# EAGLE design FFC-Extender_v10 (EAGLE 7.3.0)
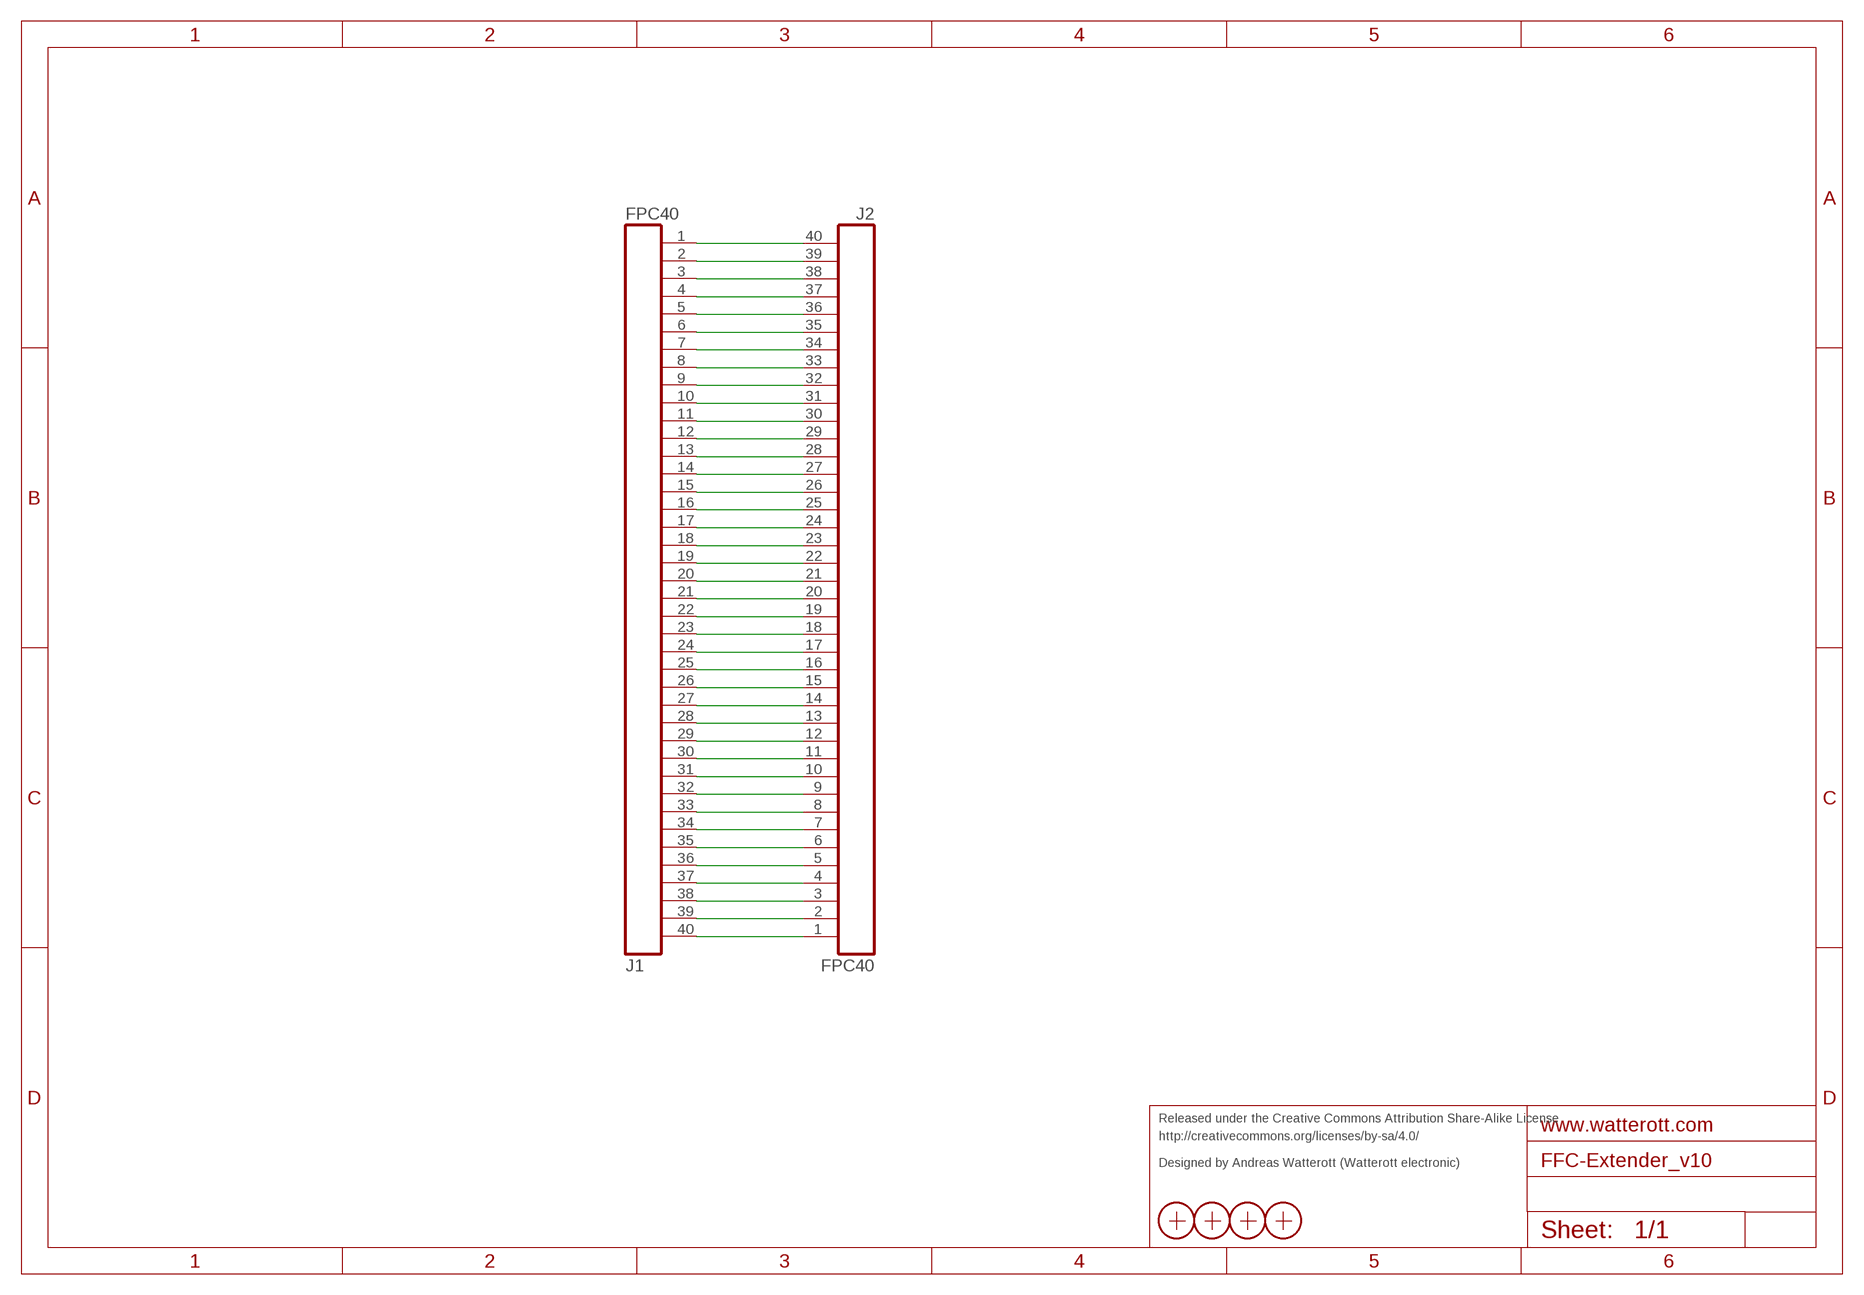
[diagram p0: schematic, sheet 1]

## Parts
J1  FPC40  [FPC40]
J2  FPC40  [FPC40]
X1  PASSER  [PASSER]
X2  PASSER  [PASSER]
X3  PASSER  [PASSER]
X4  PASSER  [PASSER]

## Nets
N$1: J1.1 J2.40
N$2: J1.2 J2.39
N$3: J1.3 J2.38
N$4: J1.4 J2.37
N$5: J1.5 J2.36
N$6: J1.6 J2.35
N$7: J1.7 J2.34
N$8: J1.8 J2.33
N$9: J1.9 J2.32
N$10: J1.10 J2.31
N$11: J1.11 J2.30
N$12: J1.12 J2.29
N$13: J1.13 J2.28
N$14: J1.14 J2.27
N$15: J1.15 J2.26
N$16: J1.16 J2.25
N$17: J1.17 J2.24
N$18: J1.18 J2.23
N$19: J1.19 J2.22
N$20: J1.20 J2.21
N$21: J1.21 J2.20
N$22: J1.22 J2.19
N$23: J1.23 J2.18
N$24: J1.24 J2.17
N$25: J1.25 J2.16
N$26: J1.26 J2.15
N$27: J1.27 J2.14
N$28: J1.28 J2.13
N$29: J1.29 J2.12
N$30: J1.30 J2.11
N$31: J1.31 J2.10
N$32: J1.32 J2.9
N$33: J1.33 J2.8
N$34: J1.34 J2.7
N$35: J1.35 J2.6
N$36: J1.36 J2.5
N$37: J1.37 J2.4
N$38: J1.38 J2.3
N$39: J1.39 J2.2
N$40: J1.40 J2.1

## Notes on the sheet
- Released under the Creative Commons Attribution Share-Alike License
- http://creativecommons.org/licenses/by-sa/4.0/
- Designed by Andreas Watterott (Watterott electronic)

## Library data of the parts
J1 J2 = we-con:FPC40: FPC/ZIF Connector FCI 62684-402100AHLF -> 40 Pins 0.5mm top contact FCI 62684-401100AHLF -> 40 Pins 0.5mm bottom contact; DIGIKEY_BOT: 62684-401100AHLF-ND; DIGIKEY_TOP: 62684-402100AHLF-ND
X1-X4 = SMD:PASSER

## Board
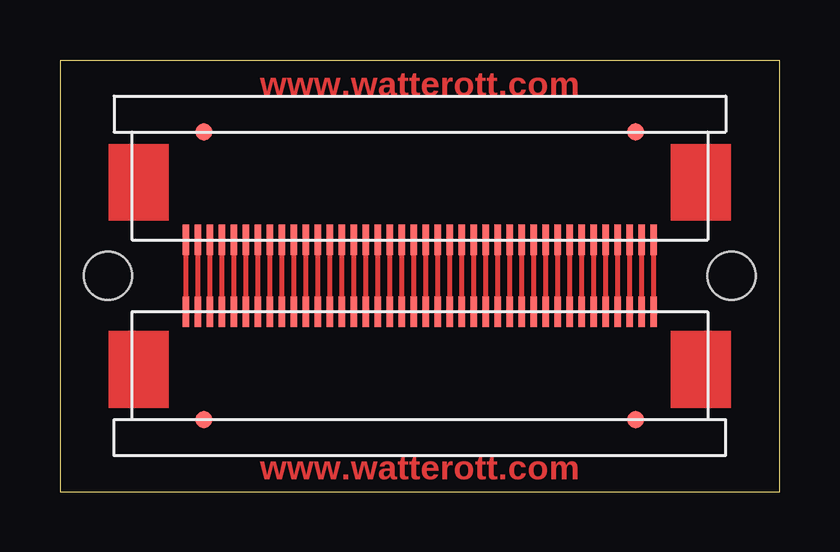
[diagram p1: board, top side]

Size 30 x 18 mm. Coordinates in mm from the lower left corner, seen from the top.
Outline: 0,0 30,0 30,18 0,18 0,0
Copper layers (1*16): Top 0.035mm / dielectric 1.5mm / Bottom 0.035mm
Design rules "we-dru": minimum track width 0.15mm, minimum drill 0.3mm, track to track 0.15mm, track to pad 0.15mm, pad to pad 0.15mm, via to via 0.15mm, smd to smd 0.1mm, copper to edge 0.5mm, drill to drill 0.2mm, minimum pad ring 0.18mm, minimum via ring 0.2mm, stop-mask expansion 0.1mm, vias tented up to drill 0.5mm, thermal gap 0.25mm
Holes 2 mm at 28,9 2,9

### Footprints (pad centres in the part's own frame; a part is rotated, then mirrored left to right if it is on the bottom)
FPC40 = smd 1.27 x 0.279: 1 0,9.75; 2 0,9.25; 3 0,8.75; 4 0,8.25; 5 0,7.75; 6 0,7.25; 7 0,6.75; 8 0,6.25; 9 0,5.75; 10 0,5.25; 11 0,4.75; 12 0,4.25; 13 0,3.75; 14 0,3.25; 15 0,2.75; 16 0,2.25; 17 0,1.75; 18 0,1.25; 19 0,0.75; 20 0,0.25; 21 0,-0.25; 22 0,-0.75; 23 0,-1.25; 24 0,-1.75; 25 0,-2.25; 26 0,-2.75; 27 0,-3.25; 28 0,-3.75; 29 0,-4.25; 30 0,-4.75; 31 0,-5.25; 32 0,-5.75; 33 0,-6.25; 34 0,-6.75; 35 0,-7.25; 36 0,-7.75; 37 0,-8.25; 38 0,-8.75; 39 0,-9.25; 40 0,-9.75
PASSER = smd 0.7 x 0.7: X 0,0

### Placement (x,y rotation side)
J1  15,7.5 270 top
J2  15,10.5 90 top
X1  6,3 0 top
X2  6,15 0 top
X3  24,15 0 top
X4  24,3 0 top

### Tracks (layer width: path | path; a pad name or v marks a point on that pad's centre or on a via)
N$1
  Top 0.2: J1.1 J2.40
N$2
  Top 0.2: J1.2 J2.39
N$3
  Top 0.2: J1.3 J2.38
N$4
  Top 0.2: J1.4 J2.37
N$5
  Top 0.2: J1.5 J2.36
N$6
  Top 0.2: J1.6 J2.35
N$7
  Top 0.2: J1.7 J2.34
N$8
  Top 0.2: J1.8 J2.33
N$9
  Top 0.2: J1.9 J2.32
N$10
  Top 0.2: J1.10 J2.31
N$11
  Top 0.2: J1.11 J2.30
N$12
  Top 0.2: J1.12 J2.29
N$13
  Top 0.2: J1.13 J2.28
N$14
  Top 0.2: J1.14 J2.27
N$15
  Top 0.2: J1.15 J2.26
N$16
  Top 0.2: J1.16 J2.25
N$17
  Top 0.2: J1.17 J2.24
N$18
  Top 0.2: J1.18 J2.23
N$19
  Top 0.2: J1.19 J2.22
N$20
  Top 0.2: J1.20 J2.21
N$21
  Top 0.2: J1.21 J2.20
N$22
  Top 0.2: J1.22 J2.19
N$23
  Top 0.2: J1.23 J2.18
N$24
  Top 0.2: J1.24 J2.17
N$25
  Top 0.2: J1.25 J2.16
N$26
  Top 0.2: J1.26 J2.15
N$27
  Top 0.2: J1.27 J2.14
N$28
  Top 0.2: J1.28 J2.13
N$29
  Top 0.2: J1.29 J2.12
N$30
  Top 0.2: J1.30 J2.11
N$31
  Top 0.2: J1.31 J2.10
N$32
  Top 0.2: J1.32 J2.9
N$33
  Top 0.2: J1.33 J2.8
N$34
  Top 0.2: J1.34 J2.7
N$35
  Top 0.2: J1.35 J2.6
N$36
  Top 0.2: J1.36 J2.5
N$37
  Top 0.2: J1.37 J2.4
N$38
  Top 0.2: J1.38 J2.3
N$39
  Top 0.2: J1.39 J2.2
N$40
  Top 0.2: J1.40 J2.1

### Text on the board
Top: www.watterott.com | www.watterott.com